# Altium schematic sheet AUDIO_AMP.SchDoc
size A4; SheetNumber: 15; SheetTotal: 15
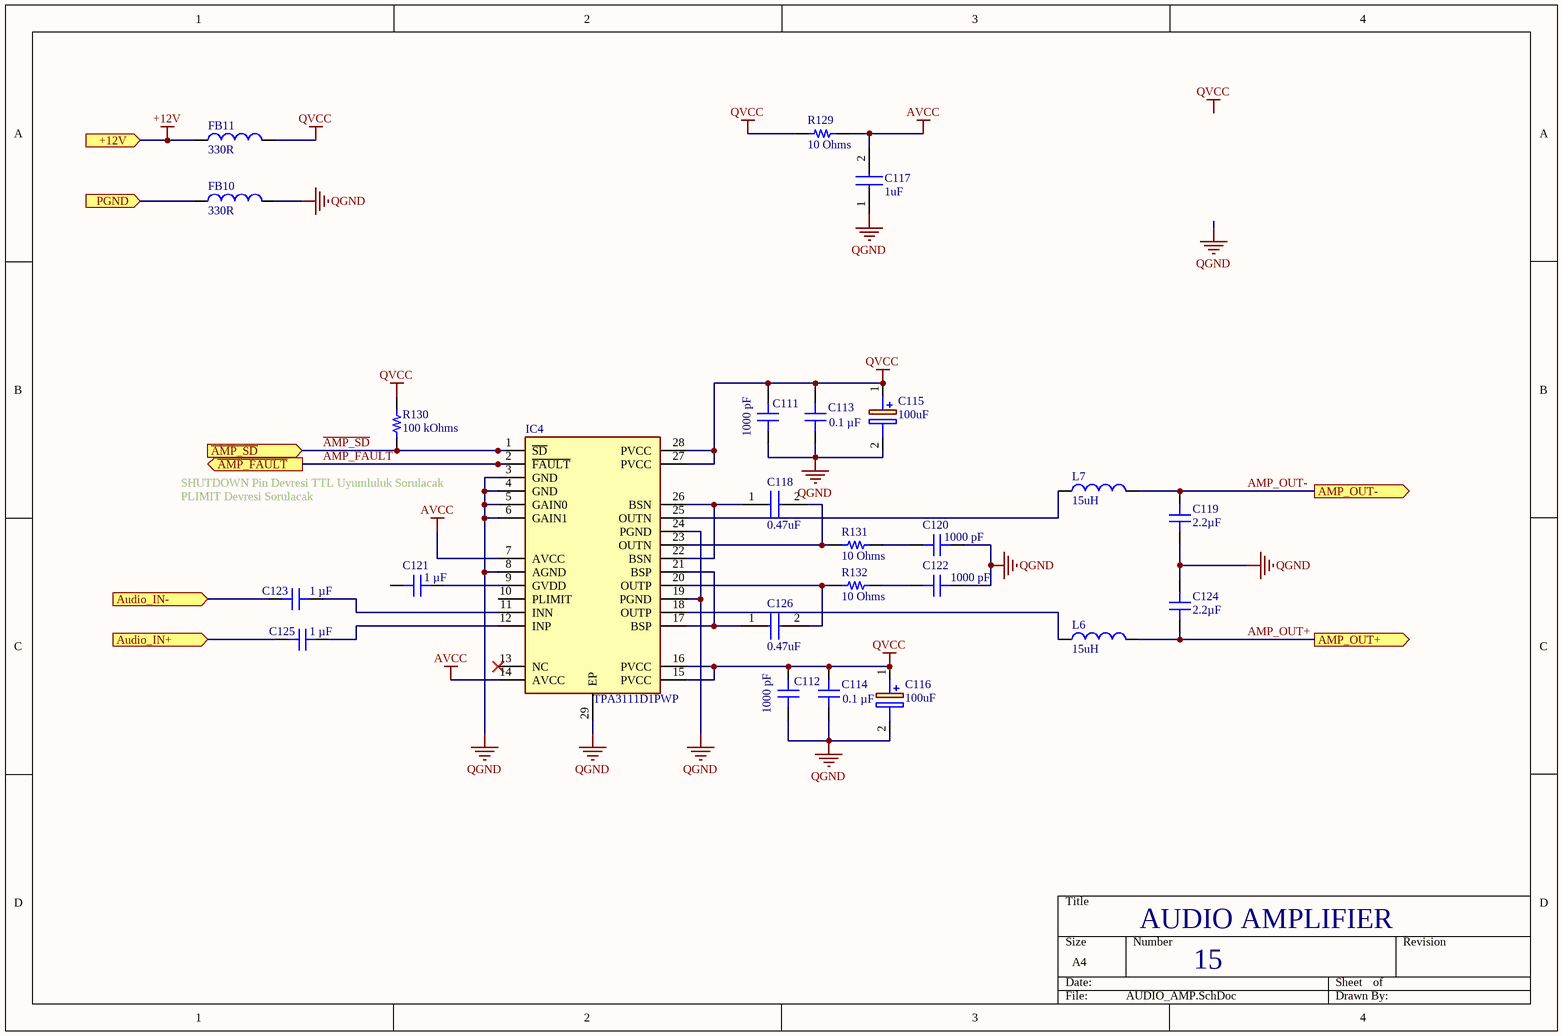
[diagram p0: AUDIO_AMP.SchDoc]

## Parts
C111  1000 pF  [CAP 0603_1608]
C112  1000 pF  [CAP 0603_1608]
C113  0.1 µF  [CAP 0603_1608]
C114  0.1 µF  [CAP 0603_1608]
C115  100uF  [EEE0JA331XP]
C116  100uF  [EEE0JA331XP]
C117  1uF  [CAPC1608X90N]
C118  0.47uF  [CAPC1608X90N]
C119  2.2µF  [CAP 1206_3216 - 1.8MM]
C120  1000 pF  [CAP 0603_1608]
C121  1 µF  [CAP 0603_1608]
C122  1000 pF  [CAP 0603_1608]
C123  1 µF  [CAP 0603_1608]
C124  2.2µF  [CAP 1206_3216 - 1.8MM]
C125  1 µF  [CAP 0603_1608]
C126  0.47uF  [CAPC1608X90N]
FB10  330R  [FB0805]
FB11  330R  [FB0805]
IC4  TPA3111D1PWP  [SOP65P640X120-29N]
L6  15uH  [IND_DG6045C]
L7  15uH  [IND_DG6045C]
R129  10 Ohms  [RES 1206_3216]
R130  100 kOhms  [RES 0603_1608]
R131  10 Ohms  [RES 0805_2012]
R132  10 Ohms  [RES 0805_2012]

## Ports
+12V (in), AMP_OUT+ (out), AMP_OUT- (out), Audio_IN+ (in), Audio_IN- (in), PGND (in), ~{AMP_FAULT} (out), ~{AMP_SD} (in)

## Nets
+12V: FB11.1 ; port +12V
AVCC: C117.2 IC4.7(AVCC) IC4.14(AVCC) R129.2
QGND: C111.1 C112.1 C113.1 C114.1 C115.2(-) C116.2(-) C117.1 C119.1 C120.2 C122.2 C124.2 FB10.2 IC4.3(GND) IC4.4(GND) IC4.5(GAIN0) IC4.6(GAIN1) IC4.8(AGND) IC4.19(PGND) IC4.24(PGND) IC4.29(EP)
QVCC: C111.2 C112.2 C113.2 C114.2 C115.1(+) C116.1(+) FB11.2 IC4.15(PVCC) IC4.16(PVCC) IC4.27(PVCC) IC4.28(PVCC) R129.1 R130.2
~{AMP_FAULT}: IC4.2(~{FAULT}) ; port ~{AMP_FAULT}
~{AMP_SD}: IC4.1(~{SD}) R130.1 ; port ~{AMP_SD}
AMP_OUT+: C124.1 L6.2 ; port AMP_OUT+
AMP_OUT-: C119.2 L7.2 ; port AMP_OUT-
Audio_IN+: C125.1 ; port Audio_IN+
Audio_IN-: C123.1 ; port Audio_IN-
PGND: FB10.1 ; port PGND
NetC118_1: C118.1 IC4.22(BSN) IC4.26(BSN)
NetC118_2: C118.2 IC4.23(OUTN) R131.1
NetC120_1: C120.1 R131.2
NetC121_2: C121.2 IC4.9(GVDD)
NetC122_1: C122.1 R132.2
NetC123_2: C123.2 IC4.11(INN)
NetC125_2: C125.2 IC4.12(INP)
NetC126_1: C126.1 IC4.17(BSP) IC4.21(BSP)
NetC126_2: C126.2 IC4.20(OUTP) R132.1
NetIC4_18: IC4.18(OUTP) L6.1
NetIC4_25: IC4.25(OUTN) L7.1

Not connected (* = marked no-connect by the designer): C121 1; IC4 10(PLIMIT) 13(NC)*

## Notes on the sheet
- (near R130) SHUTDOWN Pin Devresi TTL Uyumluluk Sorulacak
- PLIMIT Devresi Sorulacak
- AUDIO AMPLIFIER
- Labels drawn without touching a wire or pin: QVCC

## Library data of the parts
C111 C112 C120 C122 = C1608X8R1H102K080AA: CAP CER 1000PF 50V X8R 0603; manufacturer: TDK Corporation; Tolerance: ±10%; Part Number: C1608X8R1H102K080AA; Value: 1000 pF; Applications: General Purpose; Capacitance: 1000 pF; componentlink1description: Datasheet; componentlink1url: https://product.tdk.com/info/en/catalog/datasheets/mlcc_commercial_hightemp_en.pdf?ref_disty=digikey; componentlink2description: DigiKey Link; componentlink2url: https://www.digikey.com/en/products/detail/tdk-corporation/C1608X8R1H102K080AA/927127; Device Package: 0603 (1608 Metric); Features: High Temperature; lastupdated: 19.06.2022 07:49:28; Lifecycle Status: Active; Minimum Order: 1; Mounting Type: Surface Mount, MLCC; Operating Temperature: -55°C ~ 150°C; Package / Case: 0603 (1608 Metric); packaging: TapeAndReel; partid: 2708; Part Status: Active; price: 0.02; series: C; Size / Dimension: 0.063" L x 0.031" W (1.60mm x 0.80mm); Supplier 1: DigiKey; Supplier Part Number 1: 445-2501-1-ND; Temperature Coefficient: X8R; Thickness (Max): 0.035" (0.90mm); Voltage - Rated: 50V
C113 C114 = CGA3E2X7R1H104K080AE: CAP CER 0.1UF 50V X7R 0603; manufacturer: TDK Corporation; Tolerance: ±10%; Part Number: CGA3E2X7R1H104K080AE; Value: 0.1 µF; Applications: Automotive, Boardflex Sensitive; Capacitance: 0.1 µF; componentlink1description: Datasheet; componentlink1url: https://product.tdk.com/info/en/catalog/datasheets/mlcc_automotive_soft_en.pdf?ref_disty=digikey; componentlink2description: DigiKey Link; componentlink2url: https://www.digikey.com/en/products/detail/tdk-corporation/CGA3E2X7R1H104K080AE/4490594; Device Package: 0603 (1608 Metric); Features: Soft Termination; lastupdated: 19.06.2022 07:49:28; Lifecycle Status: Active; Minimum Order: 1; Mounting Type: Surface Mount, MLCC; Operating Temperature: -55°C ~ 125°C; Package / Case: 0603 (1608 Metric); packaging: TapeAndReel; partid: 2715; Part Status: Active; price: 0.01; Ratings: AEC-Q200; series: CGA; Size / Dimension: 0.063" L x 0.031" W (1.60mm x 0.80mm); Supplier 1: DigiKey; Supplier Part Number 1: 445-15957-1-ND; Temperature Coefficient: X7R; Thickness (Max): 0.037" (0.95mm); Voltage - Rated: 50V
C115 C116 = EEE-1VA101XP: Capacitor Polarised; Manufacturer_Name: Panasonic; Datasheet Link: http://industrial.panasonic.com/cdbs/www-data/pdf/RDE0000/ABA0000C1145.pdf; Height: 7.8mm; Manufacturer_Part_Number: EEE-1VA101XP; Mouser Part Number: 667-EEE-1VA101XP; Mouser Price/Stock: https://www.mouser.co.uk/ProductDetail/Panasonic/EEE-1VA101XP?qs=wEytwf7f49FM0EqQXrBRGQ%3D%3D; Arrow Part Number: EEE-1VA101XP; Arrow Price/Stock: https://www.arrow.com/en/products/eee-1va101xp/panasonic
C117 = GMK107BJ105KA-T: Capacitor; Manufacturer_Name: TAIYO YUDEN; Datasheet Link: https://datasheet.datasheetarchive.com/originals/distributors/Datasheets-DGA10/2404957.pdf; Height: 0.9mm; Manufacturer_Part_Number: GMK107BJ105KA-T; Mouser Part Number: 963-GMK107BJ105KA-T; Mouser Price/Stock: https://www.mouser.co.uk/ProductDetail/Taiyo-Yuden/GMK107BJ105KA-T?qs=I6KAKw0tg2ykHAqS8PSP9Q%3D%3D
C118 C126 = 0603YD474KAT2A: Capacitor; Manufacturer_Name: AVX; Datasheet Link: http://www.mouser.com/catalog/supplier/library/pdf/AVXSurfaceMountCeramic.pdf; Height: 0.9mm; Manufacturer_Part_Number: 0603YD474KAT2A; Mouser Part Number: 581-0603YD474K; Mouser Price/Stock: https://www.mouser.com/Search/Refine.aspx?Keyword=581-0603YD474K; Arrow Part Number: 0603YD474KAT2A; Arrow Price/Stock: https://www.arrow.com/en/products/0603yd474kat2a/avx
C119 C124 = 12065C225K4T2A: CAP CER 2.2UF 50V X7R 1206; manufacturer: AVX Corporation; Tolerance: ±10%; Part Number: 12065C225K4T2A; Value: 2.2µF; Applications: Automotive; Capacitance: 2.2µF; componentlink1description: Datasheet; componentlink1url: http://datasheets.avx.com/AutoMLCC.pdf; componentlink2description: DigiKey Link; componentlink2url: http://digikey.com/product-detail/en/avx-corporation/12065C225K4T2A/478-9558-1-ND/5322896; Device Package: 1206 (3216 Metric); lastupdated: 2.09.2020 01:05:40; Lifecycle Status: Active; Minimum Order: 1; Mounting Type: Surface Mount, MLCC; Operating Temperature: -55°C ~ 125°C; Package / Case: 1206 (3216 Metric); packaging: TapeAndReel; partid: 20175; Part Status: Active; price: 0.14; Ratings: AEC-Q200; series: -; Size / Dimension: 0.126" L x 0.063" W (3.20mm x 1.60mm); Supplier 1: DigiKey; Supplier Part Number 1: 478-9558-1-ND; Temperature Coefficient: X7R; Thickness (Max): 0.070" (1.78mm); Voltage - Rated: 50V
C121 C123 C125 = C0603C105K4PAC7867: CAP CER 1UF 16V X5R 0603; manufacturer: KEMET; Tolerance: ±10%; Part Number: C0603C105K4PAC7867; Value: 1 µF; Applications: Bypass, Decoupling; Capacitance: 1 µF; componentlink1description: Datasheet; componentlink1url: https://api.kemet.com/component-edge/download/datasheet/C0603C105K4PACTU.pdf; componentlink2description: DigiKey Link; componentlink2url: https://www.digikey.com/en/products/detail/kemet/C0603C105K4PAC7867/1465595; Device Package: 0603 (1608 Metric); lastupdated: 22.06.2022 12:58:40; Lifecycle Status: Active; Minimum Order: 1; Mounting Type: Surface Mount, MLCC; Operating Temperature: -55°C ~ 85°C; Package / Case: 0603 (1608 Metric); packaging: TapeAndReel; partid: 39785; Part Status: Active; price: 0.01; series: SMD Comm X5R; Size / Dimension: 0.063" L x 0.031" W (1.60mm x 0.80mm); Supplier 1: DigiKey; Supplier Part Number 1: 399-C0603C105K4PAC7867CT-ND; Temperature Coefficient: X5R; Thickness (Max): 0.035" (0.90mm); Voltage - Rated: 16V
FB10 FB11 = FB0805_330R@100MHz: FERRITE BEAD 330 OHM 0805 1LN; P/N: MPZ2012S331AT000; Order Code: DIGI : 445-1569-1-ND; Value: 330R @ 100MHz
IC4 = TPA3111D1PWP: Integrated Circuit; Manufacturer_Name: Texas Instruments; Datasheet Link: http://www.ti.com/lit/gpn/TPA3111D1; Height: 1.2mm; Manufacturer_Part_Number: TPA3111D1PWP; Mouser Part Number: 595-TPA3111D1PWP; Mouser Price/Stock: https://www.mouser.co.uk/ProductDetail/Texas-Instruments/TPA3111D1PWP?qs=c7TMWs5treRkFTD%2FwyLpdA%3D%3D; Arrow Part Number: TPA3111D1PWP; Arrow Price/Stock: https://www.arrow.com/en/products/tpa3111d1pwp/texas-instruments?region=nac
L6 L7 = IND_1255AY-150M=P3: FIXED IND 15UH 2.5A 75.6 MOHM; Order Code: DIGI : 490-10802-1-ND; P/N: 1255AY-150M=P3; Value: 15uH
R129 = RK73G2BTTD10R0F: RESISTOR THICK FILM 1206; Manufacturer: KOA Speer Electronics, Inc.; Power (Watts): 0.25W, 1/4W; Temperature Coefficient: ±50ppm/°C; Tolerance: ±1%; Part Number: RK73G2BTTD10R0F; ComponentLink1Description: Datasheet; ComponentLink1URL: https://www.koaspeer.com/pdfs/RK73G.pdf; ComponentLink2Description: DigiKey Link; ComponentLink2URL: https://www.digikey.com/en/products/detail/koa-speer-electronics-inc/RK73G2BTTD10R0F/13590339; Composition: Thick Film; Device Package: 1206 (3216 Metric); Features: Automotive AEC-Q200, Moisture Resistant; Height - Seated (Max): 0.028" (0.70mm); LastUpdated: 22.06.2022 13:25:03; Lifecycle Status: Active; Minimum Order: 1; Number of Terminations: 2; Operating Temperature: -55°C ~ 155°C; Package / Case: 1206 (3216 Metric); Packaging: TapeAndReel; PartId: 66090; Part Status: Active; Price: 0.03; Ratings: AEC-Q200; Resistance: 10 Ohms; Series: RK73G; Size / Dimension: 0.126" L x 0.063" W (3.20mm x 1.60mm); Supplier 1: DigiKey; Supplier Part Number 1: 2019-RK73G2BTTD10R0FCT-ND; Supplier Device Package: 1206; Value: 10 Ohms
R130 = RMCF0603JT100K: RES 100K OHM 5% 1/10W 0603; Manufacturer: Stackpole Electronics Inc; Power (Watts): 0.1W, 1/10W; Temperature Coefficient: ±200ppm/°C; Part Number: RMCF0603JT100K; Value: 100 kOhms; ComponentLink1Description: Datasheet; ComponentLink1URL: https://www.seielect.com/catalog/sei-rmcf_rmcp.pdf; ComponentLink2Description: DigiKey Link; ComponentLink2URL: https://www.digikey.com/en/products/detail/stackpole-electronics-inc/RMCF0603JT100K/1758100; Composition: Thick Film; Device Package: 0603 (1608 Metric); Features: Automotive AEC-Q200; Height - Seated (Max): 0.022" (0.55mm); LastUpdated: 19.06.2022 08:08:33; Lifecycle Status: Active; Minimum Order: 1; Number of Terminations: 2; Operating Temperature: -55°C ~ 155°C; Package / Case: 0603 (1608 Metric); Packaging: CutTape; PartId: 5863; Part Status: Active; Price: 0.01; Ratings: AEC-Q200; Resistance: 100 kOhms; Series: RMCF; Size / Dimension: 0.061" L x 0.031" W (1.55mm x 0.80mm); Supplier 1: DigiKey; Supplier Part Number 1: RMCF0603JT100KCT-ND; Supplier Device Package: 0603; Tolerance: ±5%
R131 R132 = RCC080510R0FKEA: RCC0805 100 10R 1% ET1 E3; Manufacturer: Vishay Dale; Power (Watts): 0.25W, 1/4W; Temperature Coefficient: ±100ppm/°C; Part Number: RCC080510R0FKEA; Value: 10 Ohms; ComponentLink1Description: Datasheet; ComponentLink1URL: https://www.vishay.com/docs/20066/rcce3.pdf; ComponentLink2Description: DigiKey Link; ComponentLink2URL: https://www.digikey.com/en/products/detail/vishay-dale/RCC080510R0FKEA/12084220; Composition: Thick Film; Device Package: 0805 (2012 Metric); Features: Automotive AEC-Q200; Height - Seated (Max): 0.020" (0.50mm); LastUpdated: 19.06.2022 08:20:18; Lifecycle Status: Active; Minimum Order: 1; Number of Terminations: 2; Operating Temperature: -55°C ~ 155°C; Package / Case: 0805 (2012 Metric); Packaging: TapeAndReel; PartId: 61123; Part Status: Active; Price: 0.02; Ratings: AEC-Q200; Resistance: 10 Ohms; Series: RCC e3; Size / Dimension: 0.079" L x 0.049" W (2.00mm x 1.25mm); Supplier 1: DigiKey; Supplier Part Number 1: 541-RCC080510R0FKEACT-ND; Supplier Device Package: 0805; Tolerance: ±1%